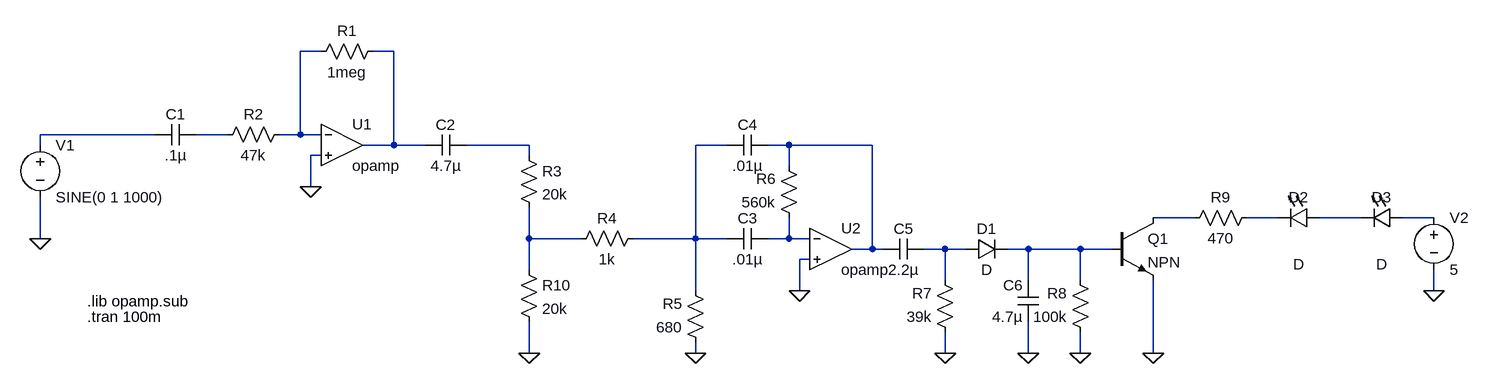
[diagram p0: schematic LEDBeatsandFreqs.asc]
LEDBeatsandFreqs.asc, the LTspice schematic file:
Version 4
SHEET 1 2348 736
WIRE 576 256 544 256
WIRE 688 256 656 256
WIRE 320 384 144 384
WIRE 432 384 384 384
WIRE 544 384 544 256
WIRE 544 384 512 384
WIRE 576 384 544 384
WIRE 144 400 144 384
WIRE 688 400 688 256
WIRE 688 400 640 400
WIRE 736 400 688 400
WIRE 896 400 800 400
WIRE 1200 400 1152 400
WIRE 1296 400 1264 400
WIRE 1424 400 1296 400
WIRE 576 416 560 416
WIRE 896 416 896 400
WIRE 1296 432 1296 400
WIRE 560 464 560 416
WIRE 1920 512 1856 512
WIRE 2048 512 2000 512
WIRE 2176 512 2112 512
WIRE 2288 512 2240 512
WIRE 144 544 144 480
WIRE 896 544 896 496
WIRE 976 544 896 544
WIRE 1152 544 1152 400
WIRE 1152 544 1056 544
WIRE 1200 544 1152 544
WIRE 1296 544 1296 512
WIRE 1296 544 1264 544
WIRE 1328 544 1296 544
WIRE 1424 560 1424 400
WIRE 1424 560 1392 560
WIRE 1440 560 1424 560
WIRE 1536 560 1504 560
WIRE 1568 560 1536 560
WIRE 1664 560 1632 560
WIRE 1744 560 1664 560
WIRE 1792 560 1744 560
WIRE 1328 576 1312 576
WIRE 896 592 896 544
WIRE 1536 608 1536 560
WIRE 1664 608 1664 560
WIRE 1744 608 1744 560
WIRE 1152 624 1152 544
WIRE 1312 624 1312 576
WIRE 2288 624 2288 592
WIRE 896 720 896 672
WIRE 1152 720 1152 704
WIRE 1536 720 1536 688
WIRE 1664 720 1664 672
WIRE 1744 720 1744 688
WIRE 1856 720 1856 608
FLAG 144 544 0
FLAG 560 464 0
FLAG 1536 720 0
FLAG 1664 720 0
FLAG 1744 720 0
FLAG 1152 720 0
FLAG 1312 624 0
FLAG 1856 720 0
FLAG 2288 624 0
FLAG 896 720 0
SYMBOL Opamps/opamp 608 336 R0
SYMATTR InstName U1
SYMBOL cap 384 368 R90
WINDOW 0 0 32 VBottom 2
WINDOW 3 32 32 VTop 2
SYMATTR InstName C1
SYMATTR Value .1µ
SYMBOL cap 800 384 R90
WINDOW 0 0 32 VBottom 2
WINDOW 3 32 32 VTop 2
SYMATTR InstName C2
SYMATTR Value 4.7µ
SYMBOL res 672 240 R90
WINDOW 0 0 56 VBottom 2
WINDOW 3 32 56 VTop 2
SYMATTR InstName R1
SYMATTR Value 1meg
SYMBOL res 528 368 R90
WINDOW 0 0 56 VBottom 2
WINDOW 3 32 56 VTop 2
SYMATTR InstName R2
SYMATTR Value 47k
SYMBOL voltage 144 384 R0
SYMATTR InstName V1
SYMATTR Value SINE(0 1 1000)
SYMBOL res 880 400 R0
SYMATTR InstName R3
SYMATTR Value 20k
SYMBOL res 1072 528 R90
WINDOW 0 0 56 VBottom 2
WINDOW 3 32 56 VTop 2
SYMATTR InstName R4
SYMATTR Value 1k
SYMBOL res 1168 720 R180
WINDOW 0 36 76 Left 2
WINDOW 3 36 40 Left 2
SYMATTR InstName R5
SYMATTR Value 680
SYMBOL res 1312 528 R180
WINDOW 0 36 76 Left 2
WINDOW 3 36 40 Left 2
SYMATTR InstName R6
SYMATTR Value 560k
SYMBOL res 1552 704 R180
WINDOW 0 36 76 Left 2
WINDOW 3 36 40 Left 2
SYMATTR InstName R7
SYMATTR Value 39k
SYMBOL res 1760 704 R180
WINDOW 0 36 76 Left 2
WINDOW 3 36 40 Left 2
SYMATTR InstName R8
SYMATTR Value 100k
SYMBOL cap 1264 528 R90
WINDOW 0 0 32 VBottom 2
WINDOW 3 32 32 VTop 2
SYMATTR InstName C3
SYMATTR Value .01µ
SYMBOL cap 1264 384 R90
WINDOW 0 0 32 VBottom 2
WINDOW 3 32 32 VTop 2
SYMATTR InstName C4
SYMATTR Value .01µ
SYMBOL cap 1504 544 R90
WINDOW 0 0 32 VBottom 2
WINDOW 3 32 32 VTop 2
SYMATTR InstName C5
SYMATTR Value 2.2µ
SYMBOL cap 1680 672 R180
WINDOW 0 24 56 Left 2
WINDOW 3 24 8 Left 2
SYMATTR InstName C6
SYMATTR Value 4.7µ
SYMBOL Opamps/opamp 1360 496 R0
SYMATTR InstName U2
SYMBOL diode 1568 576 R270
WINDOW 0 32 32 VTop 2
WINDOW 3 0 32 VBottom 2
SYMATTR InstName D1
SYMBOL npn 1792 512 R0
SYMATTR InstName Q1
SYMBOL LED 2112 496 R90
WINDOW 0 0 32 VBottom 2
WINDOW 3 72 32 VTop 2
SYMATTR InstName D2
SYMBOL LED 2240 496 R90
WINDOW 0 0 32 VBottom 2
WINDOW 3 72 32 VTop 2
SYMATTR InstName D3
SYMBOL res 2016 496 R90
WINDOW 0 0 56 VBottom 2
WINDOW 3 32 56 VTop 2
SYMATTR InstName R9
SYMATTR Value 470
SYMBOL voltage 2288 496 R0
SYMATTR InstName V2
SYMATTR Value 5
SYMBOL res 880 576 R0
SYMATTR InstName R10
SYMATTR Value 20k
TEXT 216 640 Left 2 !.lib opamp.sub
TEXT 216 664 Left 2 !.tran 100m

The netlist it stands for:
* LEDBeatsandFreqs.asc
XU1 N001 0 N002 opamp Aol=100K GBW=10Meg  ; pins invin noninvin out
C1 N004 N003 .1µ
C2 N005 N002 4.7µ
R1 N002 N001 1meg
R2 N001 N004 47k
V1 N003 0 SINE(0 1 1000)
R3 N005 N012 20k
R4 N006 N012 1k
R5 0 N006 680
R6 N013 N007 560k
R7 0 N014 39k
R8 0 N015 100k
C3 N013 N006 .01µ
C4 N007 N006 .01µ
C5 N014 N007 2.2µ
C6 0 N015 4.7µ
XU2 N013 0 N007 opamp Aol=100K GBW=10Meg  ; pins invin noninvin out
D1 N014 N015 D
Q1 N008 N015 0 0 NPN
D2 N010 N009 D
D3 N011 N010 D
R9 N009 N008 470
V2 N011 0 5
R10 N012 0 20k
.model D D
.lib standard.dio
.model NPN NPN
.model PNP PNP
.lib standard.bjt
.lib opamp.sub
.tran 100m
.backanno
.end